# Altium project project_pankov_control_board.PrjPcb
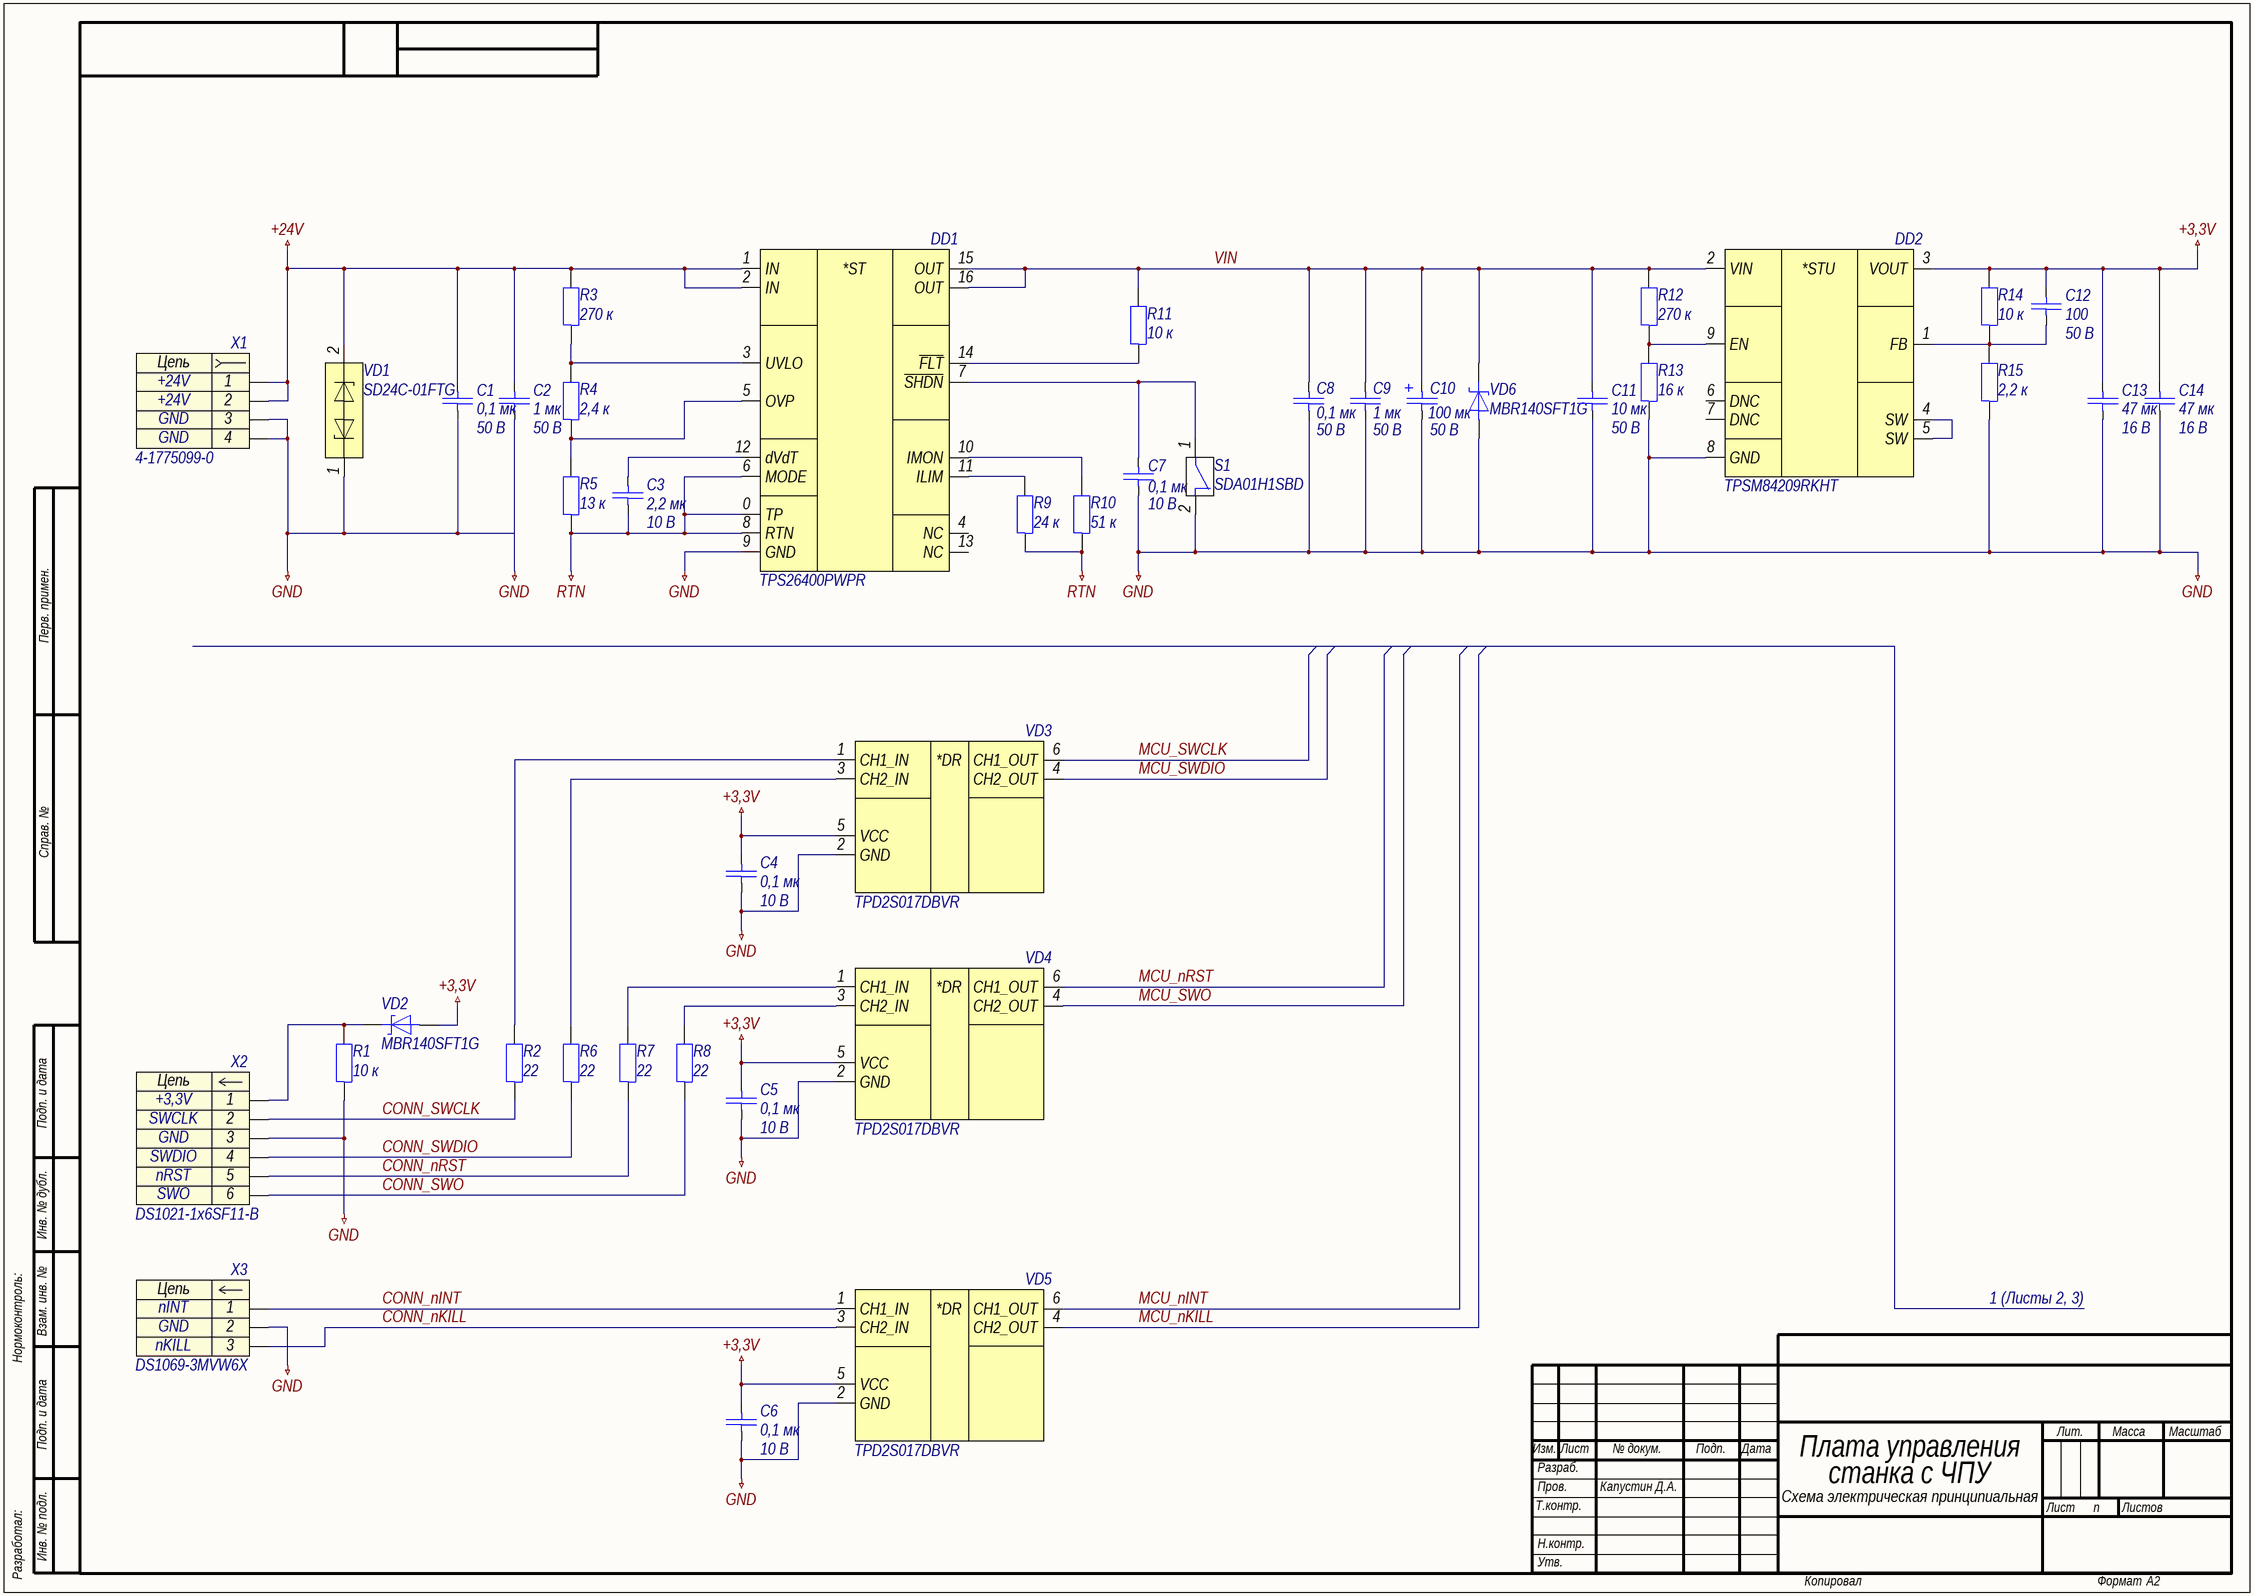
[diagram p0: project_pankov_1_power_supply.SchDoc]
approver: Капустин Д.А.; check: Капустин Д.А.; designation: СПБПУ.3331506.019; developer: Паньков И.С.; document_code: Ý3; document_type: Схема электрическая принципиальная; pcb_dec_number: СПБПУ.3331506.019; project: Плата управления станка с ЧПУ; sheets_total: 3; title: Плата управления станка с ЧПУ; title_line_1: Плата управления; title_line_2: станка с ЧПУ
3 sheets, 103 parts. Net scope: global (net labels, ports and power ports of the same name join across sheets).
Board file: project_pankov_control_board.PcbDoc
Sheets:
  project_pankov_1_power_supply.SchDoc
  project_pankov_2_mcu.SchDoc
  project_pankov_3_connectors.SchDoc

## Sheet project_pankov_1_power_supply.SchDoc: Плата управления станка с ЧПУ
size 594 x 420 mm; ApprovedBy: Капустин Д.А.; CheckedBy: Капустин Д.А.; DrawnBy: Паньков И.С.; DocumentNumber: СПБПУ.3331506.019Ý3; SheetNumber: n; SheetTotal: 3; DocumentCode: Ý3; ImagePath: СПБПУ.3331506.019

### Parts
C1  0,1 мк  Напряжение: 50 В  [C0603]
C2  1 мк  Напряжение: 50 В  [C0603]
C3  2,2 мк  Напряжение: 10 В  [C0603]
C4  0,1 мк  Напряжение: 10 В  [C0603]
C5  0,1 мк  Напряжение: 10 В  [C0603]
C6  0,1 мк  Напряжение: 10 В  [C0603]
C7  0,1 мк  Напряжение: 10 В  [C0603]
C8  0,1 мк  Напряжение: 50 В  [C0603]
C9  1 мк  Напряжение: 50 В  [C0603]
C10  100 мк  Напряжение: 50 В  [CAPAE-660X660X800]
C11  10 мк  Напряжение: 50 В  [C1206]
C12  100  Напряжение: 50 В  [C0603]
C13  47 мк  Напряжение: 16 В  [C1206]
C14  47 мк  Напряжение: 16 В  [C1206]
DD1  TPS26400PWPR  [HTSSOP-16-P65-500X440X120-L63X25-T246X266]
DD2  TPSM84209RKHT  [QFN-FCMOD-9-P65-450X400X210]
R1  10 к  [R0603]
R2  22  [R0603]
R3  270 к  [R0603]
R4  2,4 к  [R0603]
R5  13 к  [R0603]
R6  22  [R0603]
R7  22  [R0603]
R8  22  [R0603]
R9  24 к  [R0603]
R10  51 к  [R0603]
R11  10 к  [R0603]
R12  270 к  [R0603]
R13  16 к  [R0603]
R14  10 к  [R0603]
R15  2,2 к  [R0603]
S1  SDA01H1SBD  [SDA01H1SBD]
VD1  SD24C-01FTG  [SOD-323-257X130X114]
VD2  MBR140SFT1G  [SOD-123FL-370X165X98]
VD3  TPD2S017DBVR  [SOT-23-6-P95-290X280X145]
VD4  TPD2S017DBVR  [SOT-23-6-P95-290X280X145]
VD5  TPD2S017DBVR  [SOT-23-6-P95-290X280X145]
VD6  MBR140SFT1G  [SOD-123FL-370X165X98]
X1  4-1775099-0  [4-1775099-0]
X2  DS1021-1x6SF11-B  [DS1021-1X6SF11-B]
X3  DS1069-3MVW6X  [DS1069-3MVW6X]

### Nets
+3,3V: C4.1 C5.1 C6.1 C12.1 C13.1 C14.1 DD2.3(VOUT) R14.2 VD2.2 VD3.5(VCC) VD4.5(VCC) VD5.5(VCC)
+24V: C1.1 C2.1 DD1.1(IN) DD1.2(IN) R3.2 VD1.2 X1.1 X1.2
GND: C1.2 C2.2 C4.2 C5.2 C6.2 C7.2 C8.2 C9.2 C10.2 C11.2 C13.2 C14.2 DD1.9(GND) DD2.8(GND) R1.1 R13.1 R15.1 S1.2 VD1.1 VD3.2(GND) VD4.2(GND) VD5.2(GND) VD6.2 X1.3 X1.4 X2.3 X3.2
RTN: C3.2 DD1.0(TP) DD1.6(MODE) DD1.8(RTN) R5.1 R9.1 R10.1
CONN_nINT: VD5.1(CH1_IN) X3.1
CONN_nKILL: VD5.3(CH2_IN) X3.3
CONN_nRST: R7.1 X2.5
CONN_SWCLK: R2.1 X2.2
CONN_SWDIO: R6.1 X2.4
CONN_SWO: R8.1 X2.6
MCU_nINT: VD5.6(CH1_OUT)
MCU_nKILL: VD5.4(CH2_OUT)
MCU_nRST: VD4.6(CH1_OUT)
MCU_SWCLK: VD3.6(CH1_OUT)
MCU_SWDIO: VD3.4(CH2_OUT)
MCU_SWO: VD4.4(CH2_OUT)
VIN: C8.1 C9.1 C10.1 C11.1 DD1.15(OUT) DD1.16(OUT) DD2.2(VIN) R11.2 R12.2 VD6.1
NetC3_1: C3.1 DD1.12(dVdT)
NetC7_1: C7.1 DD1.7(~{SHDN}) S1.1
NetC12_2: C12.2 DD2.1(FB) R14.1 R15.2
NetDD1_3: DD1.3(UVLO) R3.1 R4.2
NetDD1_5: DD1.5(OVP) R4.1 R5.2
NetDD1_10: DD1.10(IMON) R10.2
NetDD1_11: DD1.11(ILIM) R9.2
NetDD1_14: DD1.14(~{FLT}) R11.1
NetDD2_4: DD2.4(SW) DD2.5(SW)
NetDD2_9: DD2.9(EN) R12.1 R13.2
NetR1_2: R1.2 VD2.1 X2.1
NetR2_2: R2.2 VD3.1(CH1_IN)
NetR6_2: R6.2 VD3.3(CH2_IN)
NetR7_2: R7.2 VD4.1(CH1_IN)
NetR8_2: R8.2 VD4.3(CH2_IN)

Not connected (* = marked no-connect by the designer): DD1 4(NC) 13(NC); DD2 6(DNC) 7(DNC)

### Notes on the sheet
- 1 (Листы 2, 3)
- Перв. примен.
- Справ. №
- Подп. и дата
- Инв. № дубл.
- Нормоконтроль:
- Взам. инв. №
- Изм.
- Лист
- № докум.
- Подп.
- Дата
- Лит.
- Масса
- Масштаб
- Т.контр.
- Пров.
- Разраб.
- Листов
- Разработал:
- Инв. № подл.
- Н.контр.
- Утв.
- Копировал
- Формат
- А2
- (in symbol dd0005) *ST
- (in symbol dd0020) *STU
- (in symbol vd0016) *DR
- (in symbol x0006) Цепь
- (in symbol x0028) Цепь
- (in symbol x0043) Цепь

### Library data of the parts
C1 C8 = c0065: =Описание; ID: c0065; Фамилия: Паньков; Описание: Конденсатор керамический чип 0603 100 нФ 50 В ±10 %; Наименование: CC0603KRX7R9BB104; Производитель: YAGEO Corp.; Отклонение: ±10 %; Рабочие температуры: от –55 °С до +125 °С; Температурный коэффициент емкости: X7R; Корпус: 0603; Номинал: 0,1 мк; Номинальное напряжение: 50 В; HelpURL: https://www.yageo.com/upload/media/product/productsearch/datasheet/mlcc/UPY-GPHC_X7R_6.3V-to-50V_20.pdf
C2 C9 = c0095: =Описание; ID: c0095; Фамилия: Паньков; Описание: Конденсатор керамический чип 0603 1 мкФ 50 В ±10 %; Наименование: CC0603KRX7R9BB105; Производитель: YAGEO Corp.; Отклонение: ±10 %; Рабочие температуры: от –55 °С до +125 °С; Температурный коэффициент емкости: X7R; Корпус: 0603; Номинал: 1 мк; Номинальное напряжение: 50 В; HelpURL: https://www.yageo.com/upload/media/product/productsearch/datasheet/mlcc/UPY-GPHC_X7R_6.3V-to-50V_20.pdf
C3 = c0100: =Описание; ID: c0100; Фамилия: Чернов; Описание: Конденсатор керамический чип 0603 2,2 мкФ 10 В ±10 %; Наименование: CC0603KRX7R6BB225; Производитель: YAGEO Corp.; Отклонение: ±10 %; Рабочие температуры: от –55 °С до +125 °С; Температурный коэффициент емкости: X7R; Корпус: 0603; Номинал: 2,2 мк; Номинальное напряжение: 10 В; HelpURL: https://www.yageo.com/upload/media/product/productsearch/datasheet/mlcc/UPY-GPHC_X7R_6.3V-to-50V_20.pdf
C4-C6 = c0077: =Описание; ID: c0077; Фамилия: Паньков; Описание: Конденсатор керамический чип 0603 100 нФ 10 В ±10 %; Наименование: CC0603KRX7R6BB104; Производитель: YAGEO Corp.; Отклонение: ±10 %; Рабочие температуры: от –55 °С до +125 °С; Температурный коэффициент емкости: X7R; Корпус: 0603; Номинал: 0,1 мк; Номинальное напряжение: 10 В; HelpURL: https://www.yageo.com/upload/media/product/productsearch/datasheet/mlcc/UPY-GPHC_X7R_6.3V-to-50V_20.pdf
C7 = c0057: =Описание; ID: c0057; Фамилия: Паньков; Описание: Конденсатор керамический чип 0603 100 нФ 10 В ±10 %; Наименование: CC0603KRX7R6BB104; Производитель: YAGEO Corp.; Отклонение: ±10 %; Рабочие температуры: от –55 °С до +125 °С; Температурный коэффициент емкости: X7R; Корпус: 0603; Номинал: 0,1 мк; Номинальное напряжение: 10 В; HelpURL: https://www.yageo.com/upload/media/product/productsearch/datasheet/mlcc/UPY-GPHC_X7R_6.3V-to-50V_20.pdf
C10 = c0168: =Описание; ID: c0168; Фамилия: Паньков; Описание: Конденсатор электролитический алюминиевый 100 мкФ 50 В ±20 %; Наименование: EEEFTH101XAP; Производитель: Panasonic Corporation; Отклонение: ±20 %; Эквивалентное последовательное сопротивление: 0,34 Ом; Среднеквадратичный размах пульсации тока: 0,35 А; Рабочие температуры: от –55 °С до +105 °С; Корпус: CAPAE (6,6 x 6,6 x 8,0); Номинал: 100 мк; Номинальное напряжение: 50 В; HelpURL: https://industrial.panasonic.com/ww/products/capacitors/aluminum-capacitors/aluminum-cap-smd/models/EEEFTH101XAP
C11 = c0148: =Описание; ID: c0148; Фамилия: Самарин; Описание: Конденсатор керамический чип 1206 10 мкФ 50 В ±10 %; Наименование: CC1206KKX5R9BB106; Производитель: YAGEO Corp.; Отклонение: ±10 %; Рабочие температуры: от –55 °С до +85 °С; Температурный коэффициент емкости: X5R; Корпус: 1206; Номинал: 10 мк; Номинальное напряжение: 50 В; HelpURL: https://www.yageo.com/upload/media/product/productsearch/datasheet/mlcc/UPY-GPHC_X5R_4V-to-50V_26.pdf
C12 = c0023: =Описание; ID: c0023; Фамилия: Паньков; Описание: Конденсатор керамический чип 0603 100 пФ 50 В ±1 %; Наименование: CC0603FRNPO9BN101; Производитель: YAGEO Corp.; Отклонение: ±1 %; Рабочие температуры: от –55 °С до +125 °С; Температурный коэффициент емкости: C0G; Корпус: 0603; Номинал: 100; Номинальное напряжение: 50 В; HelpURL: https://www.yageo.com/upload/media/product/productsearch/datasheet/mlcc/UPY-GP_NP0_16V-to-50V_18.pdf
C13 C14 = c0166: =Описание; ID: c0166; Фамилия: Паньков; Описание: Конденсатор керамический чип 1206 47 мкФ 16 В ±20 %; Наименование: CC1206MKX5R7BB476; Производитель: YAGEO Corp.; Отклонение: ±20 %; Рабочие температуры: от –55 °С до +85 °С; Температурный коэффициент емкости: X5R; Корпус: 1206; Номинал: 47 мк; Номинальное напряжение: 16 В; HelpURL: https://www.yageo.com/upload/media/product/productsearch/datasheet/mlcc/UPY-GPHC_X5R_4V-to-50V_26.pdf
DD1 = dd0005: =Описание; ID: dd0005; Фамилия: Паньков; Описание: Защитная микросхема eFuse 42 В и 2 А; Производитель: Texas Instruments Inc.; Напряжение: от 4,2 В до 42 В; Максимальное напряжение: 55 В; Ток: от 0,1 А до 2,23 А; Рабочие температуры: от –40 °С до +125 °С; Корпус: HTSSOP-16; Наименование: TPS26400PWPR; HelpURL: https://www.ti.com/product/TPS2640
DD2 = dd0020: =Описание; ID: dd0020; Фамилия: Паньков; Описание: Понижающий преобразователь напряжения 28 В и 2,5 А; Производитель: Texas Instruments Inc.; Входное напряжение: от 4,5 В до 28 В; Выходное напряжение: от 1,2 В до 6 В; Коммутируемый ток: до 2,5 А; Частота переключения: от 578 кГц до 923 кГц; Рабочие температуры: от –40 °С до +85 °С; Корпус: QFN-FCMOD-9; Наименование: TPSM84209RKHT; HelpURL: https://www.ti.com/product/TPSM84209
R1 R11 R14 = r0105: =Описание; ID: r0105; Фамилия: Самарин; Описание: Резистор чип 0603 10 кОм ±1 % 0,1 Вт; Наименование: RC0603FR-0710KL; Производитель: YAGEO Corp.; Отклонение: ±1 %; Номинальное напряжение: 75 В; Номинальный ток: 1 А; Рабочие температуры: от –55 °С до +155 °С; Корпус: 0603; Примечание: Ряд E24; Номинал: 10 к; HelpURL: https://www.yageo.com/upload/media/product/productsearch/datasheet/rchip/PYu-RC_Group_51_RoHS_L_11.pdf
R2 R6-R8 = r0034: =Описание; ID: r0034; Фамилия: Ларионов; Описание: Резистор чип 0603 22 Ом ±1 % 0,1 Вт; Наименование: RC0603FR-0722RL; Производитель: YAGEO Corp.; Отклонение: ±1 %; Номинальное напряжение: 75 В; Номинальный ток: 1 А; Рабочие температуры: от –55 °С до +155 °С; Корпус: 0603; Примечание: Ряд E24; Номинал: 22; HelpURL: https://www.yageo.com/upload/media/product/productsearch/datasheet/rchip/PYu-RC_Group_51_RoHS_L_11.pdf
R3 R12 = r0157: =Описание; ID: r0157; Фамилия: Паньков; Описание: Резистор чип 0603 270 кОм ±1 % 0,1 Вт; Наименование: RC0603FR-07270KL; Производитель: YAGEO Corp.; Отклонение: ±1 %; Номинальное напряжение: 75 В; Номинальный ток: 1 А; Рабочие температуры: от –55 °С до +155 °С; Корпус: 0603; Примечание: Ряд E24; Номинал: 270 к; HelpURL: https://www.yageo.com/upload/media/product/productsearch/datasheet/rchip/PYu-RC_Group_51_RoHS_L_11.pdf
R4 = r0086: =Описание; ID: r0086; Фамилия: Паньков; Описание: Резистор чип 0603 2,4 кОм ±1 % 0,1 Вт; Наименование: RC0603FR-072K4L; Производитель: YAGEO Corp.; Отклонение: ±1 %; Номинальное напряжение: 75 В; Номинальный ток: 1 А; Рабочие температуры: от –55 °С до +155 °С; Корпус: 0603; Примечание: Ряд E24; Номинал: 2,4 к; HelpURL: https://www.yageo.com/upload/media/product/productsearch/datasheet/rchip/PYu-RC_Group_51_RoHS_L_11.pdf
R5 = r0110: =Описание; ID: r0110; Фамилия: Жернаков; Описание: Резистор чип 0603 13 кОм ±1 % 0,1 Вт; Наименование: RC0603FR-0713KL; Производитель: YAGEO Corp.; Отклонение: ±1 %; Номинальное напряжение: 75 В; Номинальный ток: 1 А; Рабочие температуры: от –55 °С до +155 °С; Корпус: 0603; Примечание: Ряд E24; Номинал: 13 к; HelpURL: https://www.yageo.com/upload/media/product/productsearch/datasheet/rchip/PYu-RC_Group_51_RoHS_L_11.pdf
R9 = r0118: =Описание; ID: r0118; Фамилия: Паньков; Описание: Резистор чип 0603 24 кОм ±1 % 0,1 Вт; Наименование: RC0603FR-0724KL; Производитель: YAGEO Corp.; Отклонение: ±1 %; Номинальное напряжение: 75 В; Номинальный ток: 1 А; Рабочие температуры: от –55 °С до +155 °С; Корпус: 0603; Примечание: Ряд E24; Номинал: 24 к; HelpURL: https://www.yageo.com/upload/media/product/productsearch/datasheet/rchip/PYu-RC_Group_51_RoHS_L_11.pdf
R10 = r0131: =Описание; ID: r0131; Фамилия: Паньков; Описание: Резистор чип 0603 51 кОм ±1 % 0,1 Вт; Наименование: RC0603FR-0751KL; Производитель: YAGEO Corp.; Отклонение: ±1 %; Номинальное напряжение: 75 В; Номинальный ток: 1 А; Рабочие температуры: от –55 °С до +155 °С; Корпус: 0603; Примечание: Ряд E24; Номинал: 51 к; HelpURL: https://www.yageo.com/upload/media/product/productsearch/datasheet/rchip/PYu-RC_Group_51_RoHS_L_11.pdf
R13 = r0112: =Описание; ID: r0112; Фамилия: Паньков; Описание: Резистор чип 0603 16 кОм ±1 % 0,1 Вт; Наименование: RC0603FR-0716KL; Производитель: YAGEO Corp.; Отклонение: ±1 %; Номинальное напряжение: 75 В; Номинальный ток: 1 А; Рабочие температуры: от –55 °С до +155 °С; Корпус: 0603; Примечание: Ряд E24; Номинал: 16 к; HelpURL: https://www.yageo.com/upload/media/product/productsearch/datasheet/rchip/PYu-RC_Group_51_RoHS_L_11.pdf
R15 = r0085: =Описание; ID: r0085; Фамилия: Паньков; Описание: Резистор чип 0603 2,2 кОм ±1 % 0,1 Вт; Наименование: RC0603FR-072K2L; Производитель: YAGEO Corp.; Отклонение: ±1 %; Номинальное напряжение: 75 В; Номинальный ток: 1 А; Рабочие температуры: от –55 °С до +155 °С; Корпус: 0603; Примечание: Ряд E24; Номинал: 2,2 к; HelpURL: https://www.yageo.com/upload/media/product/productsearch/datasheet/rchip/PYu-RC_Group_51_RoHS_L_11.pdf
S1 = s0005: =Описание; ID: s0005; Фамилия: Паньков; Описание: 2-х позиционный движковый переключатель; Производитель: C&K; Ток нагрузки: 100 мА @ 5 В; Сопротивление контакта: 50 мОм; Количество контактов: 2; Рабочие температуры: от –40 °С до +85 °С; Промывка: Запрещена; Корпус: 4,52 х 9,30 х 5,45; Наименование: SDA01H1SBD; HelpURL: https://www.ckswitches.com/products/switches/product-details/DIP/SDA/SDA01H1SBD/
VD1 = vd0007: =Описание; ID: vd0007; Фамилия: Игнатова; Описание: Двунаправленная диодная сборка для подавления помех 24 В; Производитель: Littelfuse, Inc.; Корпус: SOD-323; Наименование: SD24C-01FTG; HelpURL: https://www.littelfuse.com/products/tvs-diode-arrays/general-purpose-esd-protection/sdc/sd24c_01ftg.aspx
VD2 VD6 = vd0002: =Описание; ID: vd0002; Фамилия: Паньков; Описание: Диод Шоттки 40 В 1 А; Производитель: ON Semiconductor; Максимальное прямое напряжение: 0,88 В; Максимальное обратное напряжение: 40 В; Максимальный прямой ток: 1 А; Рабочие температуры: от –55 °С до +125 °С; Корпус: SOD-123FL; Наименование: MBR140SFT1G; HelpURL: https://www.onsemi.com/products/discretes-drivers/diodes-rectifiers/schottky-diodes-schottky-rectifiers/mbr140sf
VD3-VD5 = vd0016: =Описание; ID: vd0016; Фамилия: Паньков; Описание: Диодная сборка для подавления помех 5 В; Производитель: Texas Instruments Inc.; Корпус: SOT-23-6; Наименование: TPD2S017DBVR; HelpURL: https://www.ti.com/product/TPD2S017
X1 = x0006: =Описание; Contact_1: +24V; Contact_3: GND; ID: x0006; Фамилия: Ларионов; Описание: ATX Power 4 pin гнездо прямой; Производитель: TE Connectivity; Contact_2: +24V; Contact_4: GND; Наименование: 4-1775099-0; HelpURL: https://www.te.com/usa-en/product-4-1775099-0.html
X2 = x0028: =Описание; Contact_1: +3,3V; Contact_2: SWCLK; Contact_3: GND; Contact_4: SWDIO; Contact_5: nRST; Contact_6: SWO; ID: x0028; Фамилия: Паньков; Описание: PLS 6 pin 2,54 мм вилка прямой; Производитель: Connfly Electronic Co., Ltd.; Наименование: DS1021-1x6SF11-B; HelpURL: http://en.connfly.group/product/xVkr=EusQssAN0gN=Aos=mU+UrVkR9kqEAN0gN9g+WqANB+A
X3 = x0043: =Описание; Contact_1: nINT; Contact_2: GND; Contact_3: nKILL; ID: x0043; Фамилия: Паньков; Описание: CWF 3 pin 2,5 мм вилка прямой; Производитель: Connfly Electronic Co., Ltd.; Наименование: DS1069-3MVW6X; HelpURL: http://en.connfly.group/product/xVkr=EusQssAN0gN=Aos=mU+UrVkR9kqEAN0gN0MUR+g+NB+A

## Sheet project_pankov_2_mcu.SchDoc: Плата управления станка с ЧПУ
size 891 x 420 mm; ApprovedBy: Капустин Д.А.; CheckedBy: Капустин Д.А.; DrawnBy: Паньков И.С.; DocumentNumber: СПБПУ.3331506.019Ý3; SheetNumber: 2; SheetTotal: 3; DocumentCode: Ý3; ImagePath: СПБПУ.3331506.019
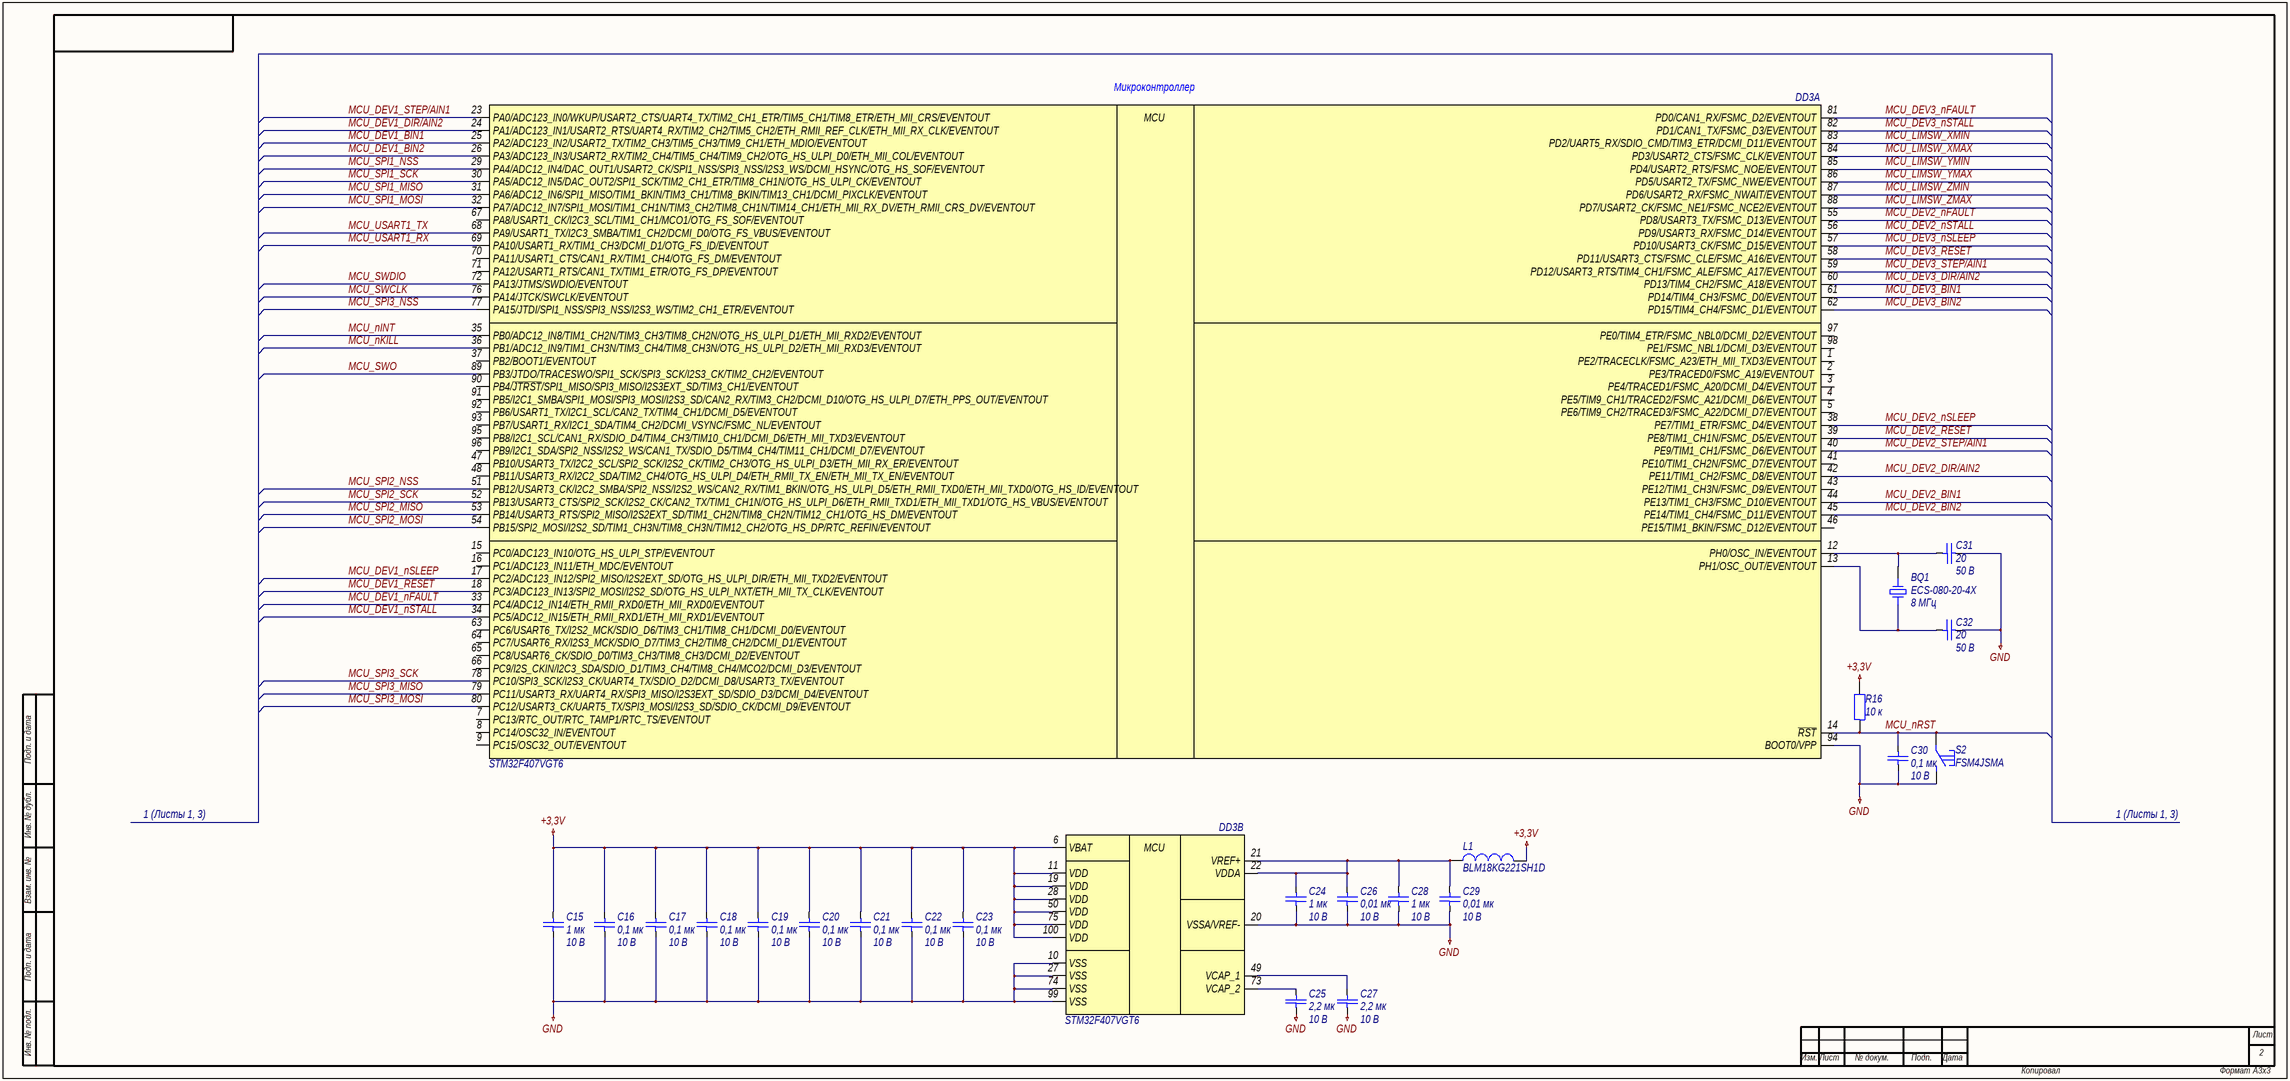
[diagram p1: project_pankov_2_mcu.SchDoc]

### Parts
BQ1  ECS-080-20-4X  Частотa: 8 МГц  [HC-49/US]
C15  1 мк  Напряжение: 10 В  [C0603]
C16  0,1 мк  Напряжение: 10 В  [C0603]
C17  0,1 мк  Напряжение: 10 В  [C0603]
C18  0,1 мк  Напряжение: 10 В  [C0603]
C19  0,1 мк  Напряжение: 10 В  [C0603]
C20  0,1 мк  Напряжение: 10 В  [C0603]
C21  0,1 мк  Напряжение: 10 В  [C0603]
C22  0,1 мк  Напряжение: 10 В  [C0603]
C23  0,1 мк  Напряжение: 10 В  [C0603]
C24  1 мк  Напряжение: 10 В  [C0603]
C25  2,2 мк  Напряжение: 10 В  [C0603]
C26  0,01 мк  Напряжение: 10 В  [C0603]
C27  2,2 мк  Напряжение: 10 В  [C0603]
C28  1 мк  Напряжение: 10 В  [C0603]
C29  0,01 мк  Напряжение: 10 В  [C0603]
C30  0,1 мк  Напряжение: 10 В  [C0603]
C31  20  Напряжение: 50 В  [C0603]
C32  20  Напряжение: 50 В  [C0603]
DD3  STM32F407VGT6  [LQFP-100-P50-1400X1400X160-L60X22]  (parts A,B of 2)
L1  BLM18KG221SH1D  [BLM-2-0603]
R16  10 к  [R0603]
S2  FSM4JSMA  [FSM4JSMA]

### Nets
+3,3V: C15.1 C16.1 C17.1 C18.1 C19.1 C20.1 C21.1 C22.1 C23.1 DD3.6(VBAT) DD3.11(VDD) DD3.19(VDD) DD3.28(VDD) DD3.50(VDD) DD3.75(VDD) DD3.100(VDD) L1.2 R16.2
GND: C15.2 C16.2 C17.2 C18.2 C19.2 C20.2 C21.2 C22.2 C23.2 C24.2 C25.2 C26.2 C27.2 C28.2 C29.2 C30.2 C31.1 C32.1 DD3.10(VSS) DD3.20(VSSA/VREF-) DD3.27(VSS) DD3.74(VSS) DD3.94(BOOT0/VPP) DD3.99(VSS) S2.2
MCU_DEV1_BIN1: DD3.25(PA2/ADC123_IN2/USART2_TX/TIM2_CH3/TIM5_CH3/TIM9_CH1/ETH_MDIO/EVENTOUT)
MCU_DEV1_BIN2: DD3.26(PA3/ADC123_IN3/USART2_RX/TIM2_CH4/TIM5_CH4/TIM9_CH2/OTG_HS_ULPI_D0/ETH_MII_COL/EVENTOUT)
MCU_DEV1_DIR/AIN2: DD3.24(PA1/ADC123_IN1/USART2_RTS/UART4_RX/TIM2_CH2/TIM5_CH2/ETH_RMII_REF_CLK/ETH_MII_RX_CLK/EVENTOUT)
MCU_DEV1_nFAULT: DD3.33(PC4/ADC12_IN14/ETH_RMII_RXD0/ETH_MII_RXD0/EVENTOUT)
MCU_DEV1_nSLEEP: DD3.17(PC2/ADC123_IN12/SPI2_MISO/I2S2EXT_SD/OTG_HS_ULPI_DIR/ETH_MII_TXD2/EVENTOUT)
MCU_DEV1_nSTALL: DD3.34(PC5/ADC12_IN15/ETH_RMII_RXD1/ETH_MII_RXD1/EVENTOUT)
MCU_DEV1_RESET: DD3.18(PC3/ADC123_IN13/SPI2_MOSI/I2S2_SD/OTG_HS_ULPI_NXT/ETH_MII_TX_CLK/EVENTOUT)
MCU_DEV1_STEP/AIN1: DD3.23(PA0/ADC123_IN0/WKUP/USART2_CTS/UART4_TX/TIM2_CH1_ETR/TIM5_CH1/TIM8_ETR/ETH_MII_CRS/EVENTOUT)
MCU_DEV2_BIN1: DD3.44(PE13/TIM1_CH3/FSMC_D10/EVENTOUT)
MCU_DEV2_BIN2: DD3.45(PE14/TIM1_CH4/FSMC_D11/EVENTOUT)
MCU_DEV2_DIR/AIN2: DD3.42(PE11/TIM1_CH2/FSMC_D8/EVENTOUT)
MCU_DEV2_nFAULT: DD3.55(PD8/USART3_TX/FSMC_D13/EVENTOUT)
MCU_DEV2_nSLEEP: DD3.38(PE7/TIM1_ETR/FSMC_D4/EVENTOUT)
MCU_DEV2_nSTALL: DD3.56(PD9/USART3_RX/FSMC_D14/EVENTOUT)
MCU_DEV2_RESET: DD3.39(PE8/TIM1_CH1N/FSMC_D5/EVENTOUT)
MCU_DEV2_STEP/AIN1: DD3.40(PE9/TIM1_CH1/FSMC_D6/EVENTOUT)
MCU_DEV3_BIN1: DD3.61(PD14/TIM4_CH3/FSMC_D0/EVENTOUT)
MCU_DEV3_BIN2: DD3.62(PD15/TIM4_CH4/FSMC_D1/EVENTOUT)
MCU_DEV3_DIR/AIN2: DD3.60(PD13/TIM4_CH2/FSMC_A18/EVENTOUT)
MCU_DEV3_nFAULT: DD3.81(PD0/CAN1_RX/FSMC_D2/EVENTOUT)
MCU_DEV3_nSLEEP: DD3.57(PD10/USART3_CK/FSMC_D15/EVENTOUT)
MCU_DEV3_nSTALL: DD3.82(PD1/CAN1_TX/FSMC_D3/EVENTOUT)
MCU_DEV3_RESET: DD3.58(PD11/USART3_CTS/FSMC_CLE/FSMC_A16/EVENTOUT)
MCU_DEV3_STEP/AIN1: DD3.59(PD12/USART3_RTS/TIM4_CH1/FSMC_ALE/FSMC_A17/EVENTOUT)
MCU_LIMSW_XMAX: DD3.84(PD3/USART2_CTS/FSMC_CLK/EVENTOUT)
MCU_LIMSW_XMIN: DD3.83(PD2/UART5_RX/SDIO_CMD/TIM3_ETR/DCMI_D11/EVENTOUT)
MCU_LIMSW_YMAX: DD3.86(PD5/USART2_TX/FSMC_NWE/EVENTOUT)
MCU_LIMSW_YMIN: DD3.85(PD4/USART2_RTS/FSMC_NOE/EVENTOUT)
MCU_LIMSW_ZMAX: DD3.88(PD7/USART2_CK/FSMC_NE1/FSMC_NCE2/EVENTOUT)
MCU_LIMSW_ZMIN: DD3.87(PD6/USART2_RX/FSMC_NWAIT/EVENTOUT)
MCU_nINT: DD3.35(PB0/ADC12_IN8/TIM1_CH2N/TIM3_CH3/TIM8_CH2N/OTG_HS_ULPI_D1/ETH_MII_RXD2/EVENTOUT)
MCU_nKILL: DD3.36(PB1/ADC12_IN9/TIM1_CH3N/TIM3_CH4/TIM8_CH3N/OTG_HS_ULPI_D2/ETH_MII_RXD3/EVENTOUT)
MCU_nRST: C30.1 DD3.14(~{RST}) R16.1 S2.1
MCU_SPI1_MISO: DD3.31(PA6/ADC12_IN6/SPI1_MISO/TIM1_BKIN/TIM3_CH1/TIM8_BKIN/TIM13_CH1/DCMI_PIXCLK/EVENTOUT)
MCU_SPI1_MOSI: DD3.32(PA7/ADC12_IN7/SPI1_MOSI/TIM1_CH1N/TIM3_CH2/TIM8_CH1N/TIM14_CH1/ETH_MII_RX_DV/ETH_RMII_CRS_DV/EVENTOUT)
MCU_SPI1_NSS: DD3.29(PA4/ADC12_IN4/DAC_OUT1/USART2_CK/SPI1_NSS/SPI3_NSS/I2S3_WS/DCMI_HSYNC/OTG_HS_SOF/EVENTOUT)
MCU_SPI1_SCK: DD3.30(PA5/ADC12_IN5/DAC_OUT2/SPI1_SCK/TIM2_CH1_ETR/TIM8_CH1N/OTG_HS_ULPI_CK/EVENTOUT)
MCU_SPI2_MISO: DD3.53(PB14/USART3_RTS/SPI2_MISO/I2S2EXT_SD/TIM1_CH2N/TIM8_CH2N/TIM12_CH1/OTG_HS_DM/EVENTOUT)
MCU_SPI2_MOSI: DD3.54(PB15/SPI2_MOSI/I2S2_SD/TIM1_CH3N/TIM8_CH3N/TIM12_CH2/OTG_HS_DP/RTC_REFIN/EVENTOUT)
MCU_SPI2_NSS: DD3.51(PB12/USART3_CK/I2C2_SMBA/SPI2_NSS/I2S2_WS/CAN2_RX/TIM1_BKIN/OTG_HS_ULPI_D5/ETH_RMII_TXD0/ETH_MII_TXD0/OTG_HS_ID/EVENTOUT)
MCU_SPI2_SCK: DD3.52(PB13/USART3_CTS/SPI2_SCK/I2S2_CK/CAN2_TX/TIM1_CH1N/OTG_HS_ULPI_D6/ETH_RMII_TXD1/ETH_MII_TXD1/OTG_HS_VBUS/EVENTOUT)
MCU_SPI3_MISO: DD3.79(PC11/USART3_RX/UART4_RX/SPI3_MISO/I2S3EXT_SD/SDIO_D3/DCMI_D4/EVENTOUT)
MCU_SPI3_MOSI: DD3.80(PC12/USART3_CK/UART5_TX/SPI3_MOSI/I2S3_SD/SDIO_CK/DCMI_D9/EVENTOUT)
MCU_SPI3_NSS: DD3.77(PA15/JTDI/SPI1_NSS/SPI3_NSS/I2S3_WS/TIM2_CH1_ETR/EVENTOUT)
MCU_SPI3_SCK: DD3.78(PC10/SPI3_SCK/I2S3_CK/UART4_TX/SDIO_D2/DCMI_D8/USART3_TX/EVENTOUT)
MCU_SWCLK: DD3.76(PA14/JTCK/SWCLK/EVENTOUT)
MCU_SWDIO: DD3.72(PA13/JTMS/SWDIO/EVENTOUT)
MCU_SWO: DD3.89(PB3/JTDO/TRACESWO/SPI1_SCK/SPI3_SCK/I2S3_CK/TIM2_CH2/EVENTOUT)
MCU_USART1_RX: DD3.69(PA10/USART1_RX/TIM1_CH3/DCMI_D1/OTG_FS_ID/EVENTOUT)
MCU_USART1_TX: DD3.68(PA9/USART1_TX/I2C3_SMBA/TIM1_CH2/DCMI_D0/OTG_FS_VBUS/EVENTOUT)
NetBQ1_1: BQ1.1 C32.2 DD3.13(PH1/OSC_OUT/EVENTOUT)
NetBQ1_2: BQ1.2 C31.2 DD3.12(PH0/OSC_IN/EVENTOUT)
NetC24_1: C24.1 C26.1 C28.1 C29.1 DD3.21(VREF+) DD3.22(VDDA) L1.1
NetC25_1: C25.1 DD3.73(VCAP_2)
NetC27_1: C27.1 DD3.49(VCAP_1)

Not connected (* = marked no-connect by the designer): DD3 1(PE2/TRACECLK/FSMC_A23/ETH_MII_TXD3/EVENTOUT) 2(PE3/TRACED0/FSMC_A19/EVENTOUT_) 3(PE4/TRACED1/FSMC_A20/DCMI_D4/EVENTOUT) 4(PE5/TIM9_CH1/TRACED2/FSMC_A21/DCMI_D6/EVENTOUT) 5(PE6/TIM9_CH2/TRACED3/FSMC_A22/DCMI_D7/EVENTOUT) 7(PC13/RTC_OUT/RTC_TAMP1/RTC_TS/EVENTOUT) 8(PC14/OSC32_IN/EVENTOUT) 9(PC15/OSC32_OUT/EVENTOUT) 15(PC0/ADC123_IN10/OTG_HS_ULPI_STP/EVENTOUT) 16(PC1/ADC123_IN11/ETH_MDC/EVENTOUT) 37(PB2/BOOT1/EVENTOUT) 41(PE10/TIM1_CH2N/FSMC_D7/EVENTOUT) 43(PE12/TIM1_CH3N/FSMC_D9/EVENTOUT) 46(PE15/TIM1_BKIN/FSMC_D12/EVENTOUT) 47(PB10/USART3_TX/I2C2_SCL/SPI2_SCK/I2S2_CK/TIM2_CH3/OTG_HS_ULPI_D3/ETH_MII_RX_ER/EVENTOUT) 48(PB11/USART3_RX/I2C2_SDA/TIM2_CH4/OTG_HS_ULPI_D4/ETH_RMII_TX_EN/ETH_MII_TX_EN/EVENTOUT) 63(PC6/USART6_TX/I2S2_MCK/SDIO_D6/TIM3_CH1/TIM8_CH1/DCMI_D0/EVENTOUT) 64(PC7/USART6_RX/I2S3_MCK/SDIO_D7/TIM3_CH2/TIM8_CH2/DCMI_D1/EVENTOUT) 65(PC8/USART6_CK/SDIO_D0/TIM3_CH3/TIM8_CH3/DCMI_D2/EVENTOUT) 66(PC9/I2S_CKIN/I2C3_SDA/SDIO_D1/TIM3_CH4/TIM8_CH4/MCO2/DCMI_D3/EVENTOUT) 67(PA8/USART1_CK/I2C3_SCL/TIM1_CH1/MCO1/OTG_FS_SOF/EVENTOUT) 70(PA11/USART1_CTS/CAN1_RX/TIM1_CH4/OTG_FS_DM/EVENTOUT) 71(PA12/USART1_RTS/CAN1_TX/TIM1_ETR/OTG_FS_DP/EVENTOUT) 90(PB4/~{JTRST}/SPI1_MISO/SPI3_MISO/I2S3EXT_SD/TIM3_CH1/EVENTOUT) 91(PB5/I2C1_SMBA/SPI1_MOSI/SPI3_MOSI/I2S3_SD/CAN2_RX/TIM3_CH2/DCMI_D10/OTG_HS_ULPI_D7/ETH_PPS_OUT/EVENTOUT) 92(PB6/USART1_TX/I2C1_SCL/CAN2_TX/TIM4_CH1/DCMI_D5/EVENTOUT) 93(PB7/USART1_RX/I2C1_SDA/TIM4_CH2/DCMI_VSYNC/FSMC_NL/EVENTOUT) 95(PB8/I2C1_SCL/CAN1_RX/SDIO_D4/TIM4_CH3/TIM10_CH1/DCMI_D6/ETH_MII_TXD3/EVENTOUT) 96(PB9/I2C1_SDA/SPI2_NSS/I2S2_WS/CAN1_TX/SDIO_D5/TIM4_CH4/TIM11_CH1/DCMI_D7/EVENTOUT) 97(PE0/TIM4_ETR/FSMC_NBL0/DCMI_D2/EVENTOUT) 98(PE1/FSMC_NBL1/DCMI_D3/EVENTOUT)

### Notes on the sheet
- (near DD3) Микроконтроллер
- 1 (Листы 1, 3)
- Подп. и дата
- Инв. № дубл.
- Взам. инв. №
- Инв. № подл.
- Лист
- Изм.
- № докум.
- Подп.
- Дата
- Копировал
- Формат
- А3х3
- (in symbol dd0002, part A) MCU
- (in symbol dd0002, part B) MCU

### Library data of the parts
BQ1 = bq0004: =Описание; ID: bq0004; Фамилия: Паньков; Описание: Кварцевый резонатор 8 МГц нагрузочные конденсаторы 20 пФ; Производитель: ECS, Inc. International; Наименование: ECS-080-20-4X; Частота: 8 МГц; Корпус: HC-49/US; HelpURL: https://ecsxtal.com/hc-49usx
C15 C24 C28 = c0086: =Описание; ID: c0086; Фамилия: Паньков; Описание: Конденсатор керамический чип 0603 1 мкФ 10 В ±10 %; Наименование: CC0603KRX7R6BB105; Производитель: YAGEO Corp.; Отклонение: ±10 %; Рабочие температуры: от –55 °С до +125 °С; Температурный коэффициент емкости: X7R; Корпус: 0603; Номинал: 1 мк; Номинальное напряжение: 10 В; HelpURL: https://www.yageo.com/upload/media/product/productsearch/datasheet/mlcc/UPY-GPHC_X7R_6.3V-to-50V_20.pdf
C16-C23 = c0054: =Описание; ID: c0054; Фамилия: Паньков; Описание: Конденсатор керамический чип 0603 100 нФ 10 В ±10 %; Наименование: CC0603KRX7R6BB104; Производитель: YAGEO Corp.; Отклонение: ±10 %; Рабочие температуры: от –55 °С до +125 °С; Температурный коэффициент емкости: X7R; Корпус: 0603; Номинал: 0,1 мк; Номинальное напряжение: 10 В; HelpURL: https://www.yageo.com/upload/media/product/productsearch/datasheet/mlcc/UPY-GPHC_X7R_6.3V-to-50V_20.pdf
C25 C27 = c0097: =Описание; ID: c0097; Фамилия: Чернов; Описание: Конденсатор керамический чип 0603 2,2 мкФ 10 В ±10 %; Наименование: CC0603KRX7R6BB225; Производитель: YAGEO Corp.; Отклонение: ±10 %; Рабочие температуры: от –55 °С до +125 °С; Температурный коэффициент емкости: X7R; Корпус: 0603; Номинал: 2,2 мк; Номинальное напряжение: 10 В; HelpURL: https://www.yageo.com/upload/media/product/productsearch/datasheet/mlcc/UPY-GPHC_X7R_6.3V-to-50V_20.pdf
C26 C29 = c0033: =Описание; ID: c0033; Фамилия: Паньков; Описание: Конденсатор керамический чип 0603 10 нФ 10 В ±10 %; Наименование: CC0603KRX7R6BB103; Производитель: YAGEO Corp.; Отклонение: ±10 %; Рабочие температуры: от –55 °С до +125 °С; Температурный коэффициент емкости: X7R; Корпус: 0603; Номинал: 0,01 мк; Номинальное напряжение: 10 В; HelpURL: https://www.yageo.com/upload/media/product/productsearch/datasheet/mlcc/UPY-GPHC_X7R_6.3V-to-50V_20.pdf
C30 = c0057: as C7 on sheet project_pankov_1_power_supply; Номинал: 0,1 мк; Номинальное напряжение: 10 В; HelpURL: https://www.yageo.com/upload/media/product/productsearch/datasheet/mlcc/UPY-GPHC_X7R_6.3V-to-50V_20.pdf
C31 C32 = c0019: =Описание; ID: c0019; Фамилия: Паньков; Описание: Конденсатор керамический чип 0603 20 пФ 50 В ±1 %; Наименование: CC0603FRNPO9BN200; Производитель: YAGEO Corp.; Отклонение: ±1 %; Рабочие температуры: от –55 °С до +125 °С; Температурный коэффициент емкости: C0G; Корпус: 0603; Номинал: 20; Номинальное напряжение: 50 В; HelpURL: https://www.yageo.com/upload/media/product/productsearch/datasheet/mlcc/UPY-GP_NP0_16V-to-50V_18.pdf
DD3 = dd0002: =Описание; ID: dd0002; Фамилия: Паньков; Описание: ARM Cortex-M4 32-разрядный микроконтроллер 168 МГц 1 Мбайт FLASH-памяти; Производитель: STMicroelectronics; Рабочее напряжение: от 1,8 В до 3,6 В; Максимальная тактовая частота: 168 МГц; Поддерживаемые интерфейсы: CAN, I2C, SDIO, I2S/SPI, UART/USART, USB; Рабочие температуры: от –40 °С до +85 °С; Корпус: LQFP-100; Наименование: STM32F407VGT6; HelpURL: https://www.st.com/en/microcontrollers-microprocessors/stm32f407vg.html
L1 = l0001: =Описание; ID: l0001; Фамилия: Ларионов; Описание: Ферритовая бусина 220 Ом ±25 %; Производитель: Murata Manufacturing Co., Ltd.; Сопротивление, 100 МГц: 220 Ом; Отклонение, 100 МГц: ±25 %; Сопротивление при постоянном токе: 0,05 Ом; Рабочие температуры: от –55 °С до +125 °С; Корпус: 0603; Наименование: BLM18KG221SH1D; HelpURL: https://www.murata.com/en-global/products/productdetail?partno=BLM18KG221SH1%23
R16 = r0105: as R1 on sheet project_pankov_1_power_supply; Номинал: 10 к; HelpURL: https://www.yageo.com/upload/media/product/productsearch/datasheet/rchip/PYu-RC_Group_51_RoHS_L_11.pdf
S2 = s0001: =Описание; ID: s0001; Фамилия: Паньков; Описание: Тактовая кнопка поверхностного монтажа; Производитель: TE Connectivity; Ток нагрузки: 50 мА @ 24 В; Сопротивление контакта: 100 мОм; Количество контактов: 4; Рабочие температуры: от –35 °С до +85 °С; Промывка: Запрещена; Корпус: 6,00 x 6,00 x 4,98; Наименование: FSM4JSMA; HelpURL: https://www.te.com/usa-en/product-4-1437565-1.html

## Sheet project_pankov_3_connectors.SchDoc: Плата управления станка с ЧПУ
size 594 x 420 mm; ApprovedBy: Капустин Д.А.; CheckedBy: Капустин Д.А.; DrawnBy: Паньков И.С.; DocumentNumber: СПБПУ.3331506.019Ý3; SheetNumber: 3; SheetTotal: 3; DocumentCode: Ý3; ImagePath: СПБПУ.3331506.019
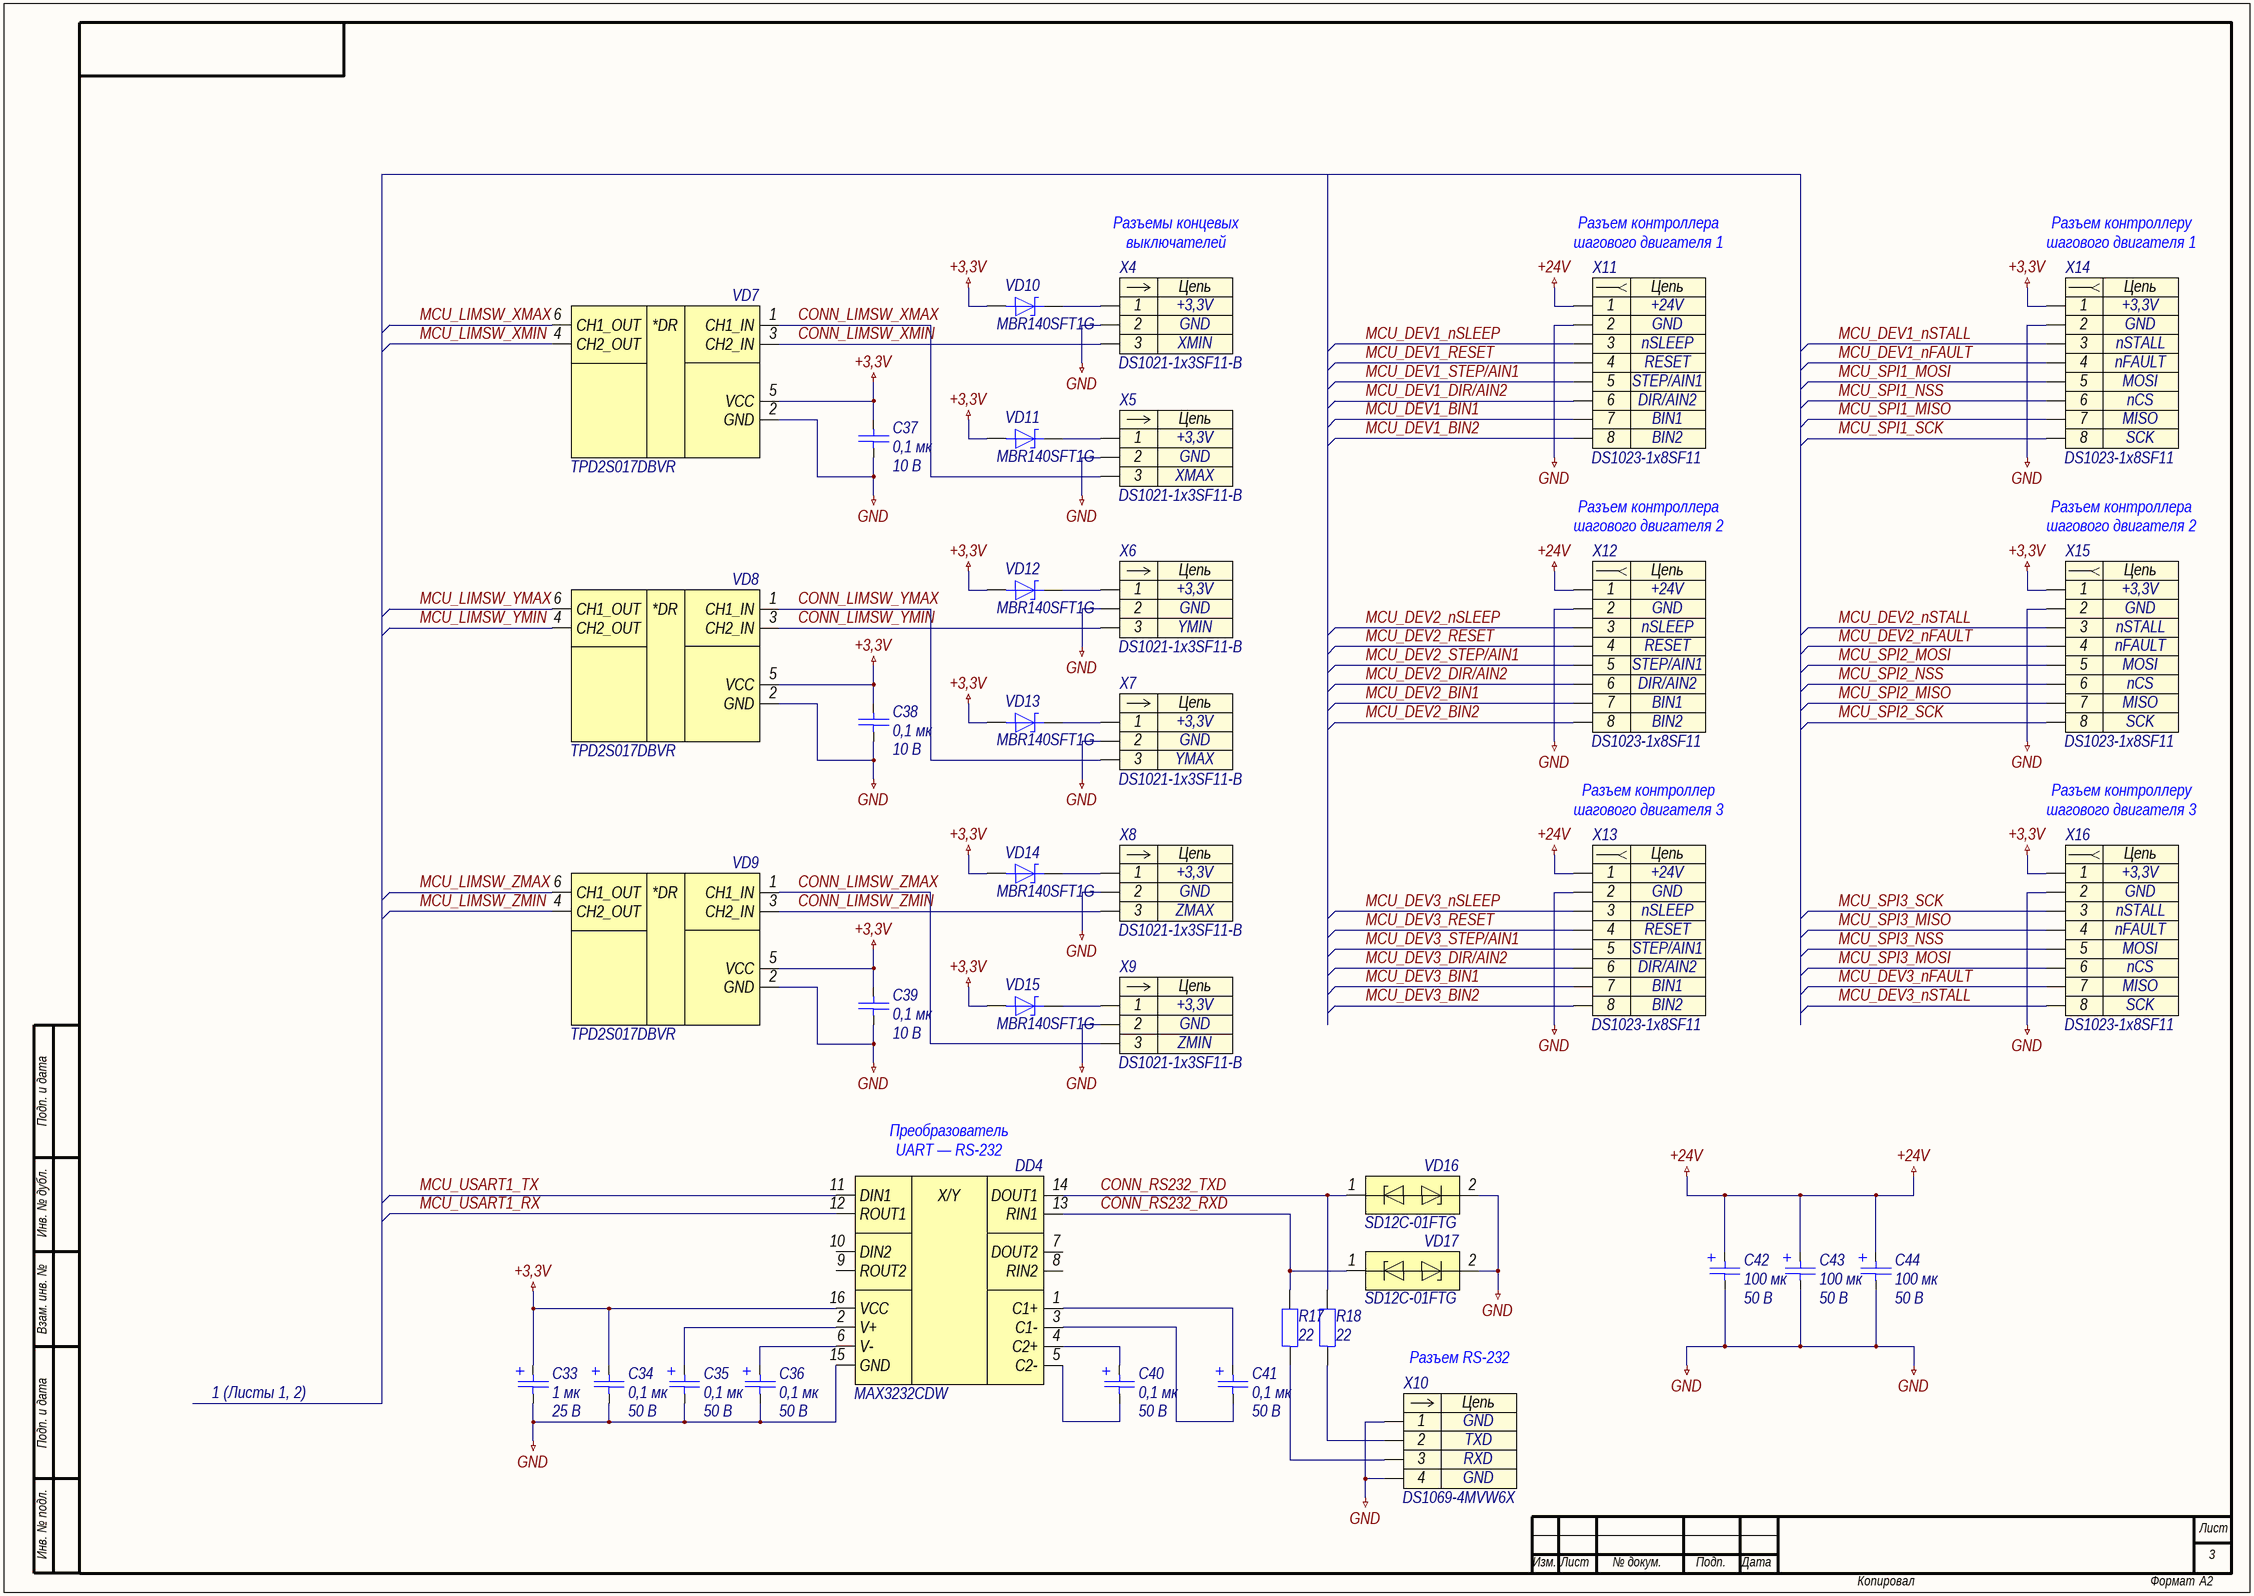
[diagram p2: project_pankov_3_connectors.SchDoc]

### Parts
C33  1 мк  Напряжение: 25 В  [C3216-18]
C34  0,1 мк  Напряжение: 50 В  [C3216-18]
C35  0,1 мк  Напряжение: 50 В  [C3216-18]
C36  0,1 мк  Напряжение: 50 В  [C3216-18]
C37  0,1 мк  Напряжение: 10 В  [C0603]
C38  0,1 мк  Напряжение: 10 В  [C0603]
C39  0,1 мк  Напряжение: 10 В  [C0603]
C40  0,1 мк  Напряжение: 50 В  [C3216-18]
C41  0,1 мк  Напряжение: 50 В  [C3216-18]
C42  100 мк  Напряжение: 50 В  [CAPAE-660X660X800]
C43  100 мк  Напряжение: 50 В  [CAPAE-660X660X800]
C44  100 мк  Напряжение: 50 В  [CAPAE-660X660X800]
DD4  MAX3232CDW  [SOIC-16-P127-1030X750X265-L84X41]
R17  22  [R0603]
R18  22  [R0603]
VD7  TPD2S017DBVR  [SOT-23-6-P95-290X280X145]
VD8  TPD2S017DBVR  [SOT-23-6-P95-290X280X145]
VD9  TPD2S017DBVR  [SOT-23-6-P95-290X280X145]
VD10  MBR140SFT1G  [SOD-123FL-370X165X98]
VD11  MBR140SFT1G  [SOD-123FL-370X165X98]
VD12  MBR140SFT1G  [SOD-123FL-370X165X98]
VD13  MBR140SFT1G  [SOD-123FL-370X165X98]
VD14  MBR140SFT1G  [SOD-123FL-370X165X98]
VD15  MBR140SFT1G  [SOD-123FL-370X165X98]
VD16  SD12C-01FTG  [SOD-323-257X130X114]
VD17  SD12C-01FTG  [SOD-323-257X130X114]
X4  DS1021-1x3SF11-B  [DS1021-1X3SF11-B]
X5  DS1021-1x3SF11-B  [DS1021-1X3SF11-B]
X6  DS1021-1x3SF11-B  [DS1021-1X3SF11-B]
X7  DS1021-1x3SF11-B  [DS1021-1X3SF11-B]
X8  DS1021-1x3SF11-B  [DS1021-1X3SF11-B]
X9  DS1021-1x3SF11-B  [DS1021-1X3SF11-B]
X10  DS1069-4MVW6X  [DS1069-4MVW6X]
X11  DS1023-1x8SF11  [DS1023-1X8SF11]
X12  DS1023-1x8SF11  [DS1023-1X8SF11]
X13  DS1023-1x8SF11  [DS1023-1X8SF11]
X14  DS1023-1x8SF11  [DS1023-1X8SF11]
X15  DS1023-1x8SF11  [DS1023-1X8SF11]
X16  DS1023-1x8SF11  [DS1023-1X8SF11]

### Nets
+3,3V: C33.1 C34.1 C37.1 C38.1 C39.1 DD4.16(VCC) VD7.5(VCC) VD8.5(VCC) VD9.5(VCC) VD10.2 VD11.2 VD12.2 VD13.2 VD14.2 VD15.2 X14.1 X15.1 X16.1
+24V: C42.1 C43.1 C44.1 X11.1 X12.1 X13.1
GND: C33.2 C34.2 C35.2 C36.2 C37.2 C38.2 C39.2 C42.2 C43.2 C44.2 DD4.15(GND) VD7.2(GND) VD8.2(GND) VD9.2(GND) VD16.2 VD17.2 X4.2 X5.2 X6.2 X7.2 X8.2 X9.2 X10.1 X10.4 X11.2 X12.2 X13.2 X14.2 X15.2 X16.2
CONN_LIMSW_XMAX: VD7.1(CH1_IN) X5.3
CONN_LIMSW_XMIN: VD7.3(CH2_IN) X4.3
CONN_LIMSW_YMAX: VD8.1(CH1_IN) X7.3
CONN_LIMSW_YMIN: VD8.3(CH2_IN) X6.3
CONN_LIMSW_ZMAX: VD9.1(CH1_IN) X9.3
CONN_LIMSW_ZMIN: VD9.3(CH2_IN) X8.3
CONN_RS232_RXD: DD4.13(RIN1) R17.2 VD17.1
CONN_RS232_TXD: DD4.14(DOUT1) R18.2 VD16.1
MCU_DEV1_BIN1: X11.7
MCU_DEV1_BIN2: X11.8
MCU_DEV1_DIR/AIN2: X11.6
MCU_DEV1_nFAULT: X14.4
MCU_DEV1_nSLEEP: X11.3
MCU_DEV1_nSTALL: X14.3
MCU_DEV1_RESET: X11.4
MCU_DEV1_STEP/AIN1: X11.5
MCU_DEV2_BIN1: X12.7
MCU_DEV2_BIN2: X12.8
MCU_DEV2_DIR/AIN2: X12.6
MCU_DEV2_nFAULT: X15.4
MCU_DEV2_nSLEEP: X12.3
MCU_DEV2_nSTALL: X15.3
MCU_DEV2_RESET: X12.4
MCU_DEV2_STEP/AIN1: X12.5
MCU_DEV3_BIN1: X13.7
MCU_DEV3_BIN2: X13.8
MCU_DEV3_DIR/AIN2: X13.6
MCU_DEV3_nFAULT: X16.7
MCU_DEV3_nSLEEP: X13.3
MCU_DEV3_nSTALL: X16.8
MCU_DEV3_RESET: X13.4
MCU_DEV3_STEP/AIN1: X13.5
MCU_LIMSW_XMAX: VD7.6(CH1_OUT)
MCU_LIMSW_XMIN: VD7.4(CH2_OUT)
MCU_LIMSW_YMAX: VD8.6(CH1_OUT)
MCU_LIMSW_YMIN: VD8.4(CH2_OUT)
MCU_LIMSW_ZMAX: VD9.6(CH1_OUT)
MCU_LIMSW_ZMIN: VD9.4(CH2_OUT)
MCU_SPI1_MISO: X14.7
MCU_SPI1_MOSI: X14.5
MCU_SPI1_NSS: X14.6
MCU_SPI1_SCK: X14.8
MCU_SPI2_MISO: X15.7
MCU_SPI2_MOSI: X15.5
MCU_SPI2_NSS: X15.6
MCU_SPI2_SCK: X15.8
MCU_SPI3_MISO: X16.4
MCU_SPI3_MOSI: X16.6
MCU_SPI3_NSS: X16.5
MCU_SPI3_SCK: X16.3
MCU_USART1_RX: DD4.12(ROUT1)
MCU_USART1_TX: DD4.11(DIN1)
NetC35_1: C35.1 DD4.2(V+)
NetC36_1: C36.1 DD4.6(V-)
NetC40_1: C40.1 DD4.4(C2+)
NetC40_2: C40.2 DD4.5(C2-)
NetC41_1: C41.1 DD4.1(C1+)
NetC41_2: C41.2 DD4.3(C1-)
NetR17_1: R17.1 X10.3
NetR18_1: R18.1 X10.2
NetVD10_1: VD10.1 X4.1
NetVD11_1: VD11.1 X5.1
NetVD12_1: VD12.1 X6.1
NetVD13_1: VD13.1 X7.1
NetVD14_1: VD14.1 X8.1
NetVD15_1: VD15.1 X9.1

Not connected (* = marked no-connect by the designer): DD4 7(DOUT2) 8(RIN2) 9(ROUT2) 10(DIN2)

### Notes on the sheet
- Разъемы концевых
  выключателей
- Разъем контроллера
  шагового двигателя 1
- Разъем контроллеру
  шагового двигателя 1
- Разъем контроллера
  шагового двигателя 2
- Разъем контроллер
  шагового двигателя 3
- Разъем контроллеру
  шагового двигателя 3
- (near DD4) Преобразователь
  UART — RS-232
- 1 (Листы 1, 2)
- Разъем RS-232
- Подп. и дата
- Инв. № дубл.
- Взам. инв. №
- Инв. № подл.
- Лист
- Изм.
- № докум.
- Подп.
- Дата
- Копировал
- Формат
- А2
- (in symbol dd0016) X/Y
- (in symbol vd0016) *DR
- (in symbol x0026) Цепь
- (in symbol x0036) Цепь
- (in symbol x0045) Цепь

### Library data of the parts
C33 = c0014: =Описание; ID: c0014; Фамилия: Ларионов; Описание: Конденсатор танталовый чип 3216-18 1 мкФ 25 В ±10 %; Наименование: 293D105X9025A2TE3; Производитель: Vishay Intertechnology, Inc.; Отклонение: ±10 %; Эквивалентное последовательное сопротивление: 7,6 Ом; Среднеквадратичный размах пульсации тока: 0,10 А; Рабочие температуры: от –55 °С до +125 °С; Корпус: 3216-18; Номинал: 1 мк; Номинальное напряжение: 25 В; HelpURL: https://www.vishay.com/capacitors/list/product-40002/
C34-C36 C40 C41 = c0001: =Описание; ID: c0001; Фамилия: Ларионов; Описание: Конденсатор танталовый чип 3216-18 100 нФ 50 В ±10 %; Наименование: 293D104X9050A2TE3; Производитель: Vishay Intertechnology, Inc.; Отклонение: ±10 %; Эквивалентное последовательное сопротивление: 19,0 Ом; Среднеквадратичный размах пульсации тока: 0,06 А; Рабочие температуры: от –55 °С до +125 °С; Корпус: 3216-18; Номинал: 0,1 мк; Номинальное напряжение: 50 В; HelpURL: https://www.vishay.com/capacitors/list/product-40002/
C37-C39 = c0077: as C4 on sheet project_pankov_1_power_supply; Номинал: 0,1 мк; Номинальное напряжение: 10 В; HelpURL: https://www.yageo.com/upload/media/product/productsearch/datasheet/mlcc/UPY-GPHC_X7R_6.3V-to-50V_20.pdf
C42-C44 = c0168: as C10 on sheet project_pankov_1_power_supply; Номинал: 100 мк; Номинальное напряжение: 50 В; HelpURL: https://industrial.panasonic.com/ww/products/capacitors/aluminum-capacitors/aluminum-cap-smd/models/EEEFTH101XAP
DD4 = dd0016: =Описание; ID: dd0016; Фамилия: Паньков; Описание: Приемопередатчик RS-232; Производитель: Texas Instruments Inc.; Рабочие температуры: от 0 до +70 °C; Корпус: SOIC-16; Наименование: MAX3232CDW; HelpURL: https://www.ti.com/product/MAX3232
R17 R18 = r0004: =Описание; ID: r0004; Фамилия: Ларионов; Описание: Резистор чип 0603 22 Ом ±1 % 0,1 Вт; Наименование: RC0603FR-0722RL; Производитель: YAGEO Corp.; Отклонение: ±1 %; Номинальное напряжение: 75 В; Номинальный ток: 1 А; Рабочие температуры: от –55 °С до +155 °С; Корпус: 0603; Примечание: Ряд E24; Номинал: 22; HelpURL: https://www.yageo.com/upload/media/product/productsearch/datasheet/rchip/PYu-RC_Group_51_RoHS_L_11.pdf
VD7-VD9 = vd0016: as VD3 on sheet project_pankov_1_power_supply; Наименование: TPD2S017DBVR; HelpURL: https://www.ti.com/product/TPD2S017
VD10-VD15 = vd0002: as VD2 on sheet project_pankov_1_power_supply; Наименование: MBR140SFT1G; HelpURL: https://www.onsemi.com/products/discretes-drivers/diodes-rectifiers/schottky-diodes-schottky-rectifiers/mbr140sf
VD16 VD17 = vd0004: =Описание; ID: vd0004; Фамилия: Ларионов; Описание: Двунаправленная диодная сборка для подавления помех 12 В; Производитель: Littelfuse, Inc.; Корпус: SOD-323; Наименование: SD12C-01FTG; HelpURL: https://www.littelfuse.com/products/tvs-diode-arrays/general-purpose-esd-protection/sdc/sd12c_01ftg.aspx
X4 = x0026: =Описание; Contact_1: +3,3V; Contact_2: GND; Contact_3: XMIN; ID: x0026; Фамилия: Паньков; Описание: PLS 3 pin 2,54 мм вилка прямой; Производитель: Connfly Electronic Co., Ltd.; Наименование: DS1021-1x3SF11-B; HelpURL: http://en.connfly.group/product/xVkr=EusQssAN0gN=Aos=mU+UrVkR9kqEAN0gN9g+WqANB+A
X5 = x0026: =Описание; Contact_1: +3,3V; Contact_2: GND; Contact_3: XMAX; ID: x0026; Фамилия: Паньков; Описание: PLS 3 pin 2,54 мм вилка прямой; Производитель: Connfly Electronic Co., Ltd.; Наименование: DS1021-1x3SF11-B; HelpURL: http://en.connfly.group/product/xVkr=EusQssAN0gN=Aos=mU+UrVkR9kqEAN0gN9g+WqANB+A
X6 = x0026: =Описание; Contact_1: +3,3V; Contact_2: GND; Contact_3: YMIN; ID: x0026; Фамилия: Паньков; Описание: PLS 3 pin 2,54 мм вилка прямой; Производитель: Connfly Electronic Co., Ltd.; Наименование: DS1021-1x3SF11-B; HelpURL: http://en.connfly.group/product/xVkr=EusQssAN0gN=Aos=mU+UrVkR9kqEAN0gN9g+WqANB+A
X7 = x0026: =Описание; Contact_1: +3,3V; Contact_2: GND; Contact_3: YMAX; ID: x0026; Фамилия: Паньков; Описание: PLS 3 pin 2,54 мм вилка прямой; Производитель: Connfly Electronic Co., Ltd.; Наименование: DS1021-1x3SF11-B; HelpURL: http://en.connfly.group/product/xVkr=EusQssAN0gN=Aos=mU+UrVkR9kqEAN0gN9g+WqANB+A
X8 = x0026: =Описание; Contact_1: +3,3V; Contact_2: GND; Contact_3: ZMAX; ID: x0026; Фамилия: Паньков; Описание: PLS 3 pin 2,54 мм вилка прямой; Производитель: Connfly Electronic Co., Ltd.; Наименование: DS1021-1x3SF11-B; HelpURL: http://en.connfly.group/product/xVkr=EusQssAN0gN=Aos=mU+UrVkR9kqEAN0gN9g+WqANB+A
X9 = x0026: =Описание; Contact_1: +3,3V; Contact_2: GND; Contact_3: ZMIN; ID: x0026; Фамилия: Паньков; Описание: PLS 3 pin 2,54 мм вилка прямой; Производитель: Connfly Electronic Co., Ltd.; Наименование: DS1021-1x3SF11-B; HelpURL: http://en.connfly.group/product/xVkr=EusQssAN0gN=Aos=mU+UrVkR9kqEAN0gN9g+WqANB+A
X10 = x0045: =Описание; Contact_1: GND; Contact_2: TXD; Contact_3: RXD; ID: x0045; Фамилия: Паньков; Описание: CWF 4 pin 2,5 мм вилка прямой; Производитель: Connfly Electronic Co., Ltd.; Contact_4: GND; Наименование: DS1069-4MVW6X; HelpURL: http://en.connfly.group/product/xVkr=EusQssAN0gN=Aos=mU+UrVkR9kqEAN0gN0MUR+g+NB+A
X11-X13 = x0036: =Описание; Contact_1: +24V; Contact_2: GND; Contact_3: nSLEEP; Contact_4: RESET; Contact_5: STEP/AIN1; Contact_6: DIR/AIN2; Contact_7: BIN1; Contact_8: BIN2; ID: x0036; Фамилия: Паньков; Описание: PBS 8 pin 2,54 мм гнездо прямой; Производитель: Connfly Electronic Co., Ltd.; Наименование: DS1023-1x8SF11; HelpURL: http://en.connfly.group/product/xVkr=EusQssAN0gN=Aos=mU+UrVkR9kqEAN0gN0AUCUNB+A
X14-X16 = x0036: =Описание; Contact_1: +3,3V; Contact_2: GND; Contact_3: nSTALL; Contact_4: nFAULT; Contact_5: MOSI; Contact_6: nCS; Contact_7: MISO; Contact_8: SCK; ID: x0036; Фамилия: Паньков; Описание: PBS 8 pin 2,54 мм гнездо прямой; Производитель: Connfly Electronic Co., Ltd.; Наименование: DS1023-1x8SF11; HelpURL: http://en.connfly.group/product/xVkr=EusQssAN0gN=Aos=mU+UrVkR9kqEAN0gN0AUCUNB+A

## Nets that join several sheets
+3,3V: project_pankov_1_power_supply (12 pins), project_pankov_2_mcu (18 pins), project_pankov_3_connectors (18 pins)
+24V: project_pankov_1_power_supply (8 pins), project_pankov_3_connectors (6 pins)
GND: project_pankov_1_power_supply (27 pins), project_pankov_2_mcu (25 pins), project_pankov_3_connectors (30 pins)
MCU_DEV1_BIN1: project_pankov_2_mcu (DD3.25), project_pankov_3_connectors (X11.7)
MCU_DEV1_BIN2: project_pankov_2_mcu (DD3.26), project_pankov_3_connectors (X11.8)
MCU_DEV1_DIR/AIN2: project_pankov_2_mcu (DD3.24), project_pankov_3_connectors (X11.6)
MCU_DEV1_nFAULT: project_pankov_2_mcu (DD3.33), project_pankov_3_connectors (X14.4)
MCU_DEV1_nSLEEP: project_pankov_2_mcu (DD3.17), project_pankov_3_connectors (X11.3)
MCU_DEV1_nSTALL: project_pankov_2_mcu (DD3.34), project_pankov_3_connectors (X14.3)
MCU_DEV1_RESET: project_pankov_2_mcu (DD3.18), project_pankov_3_connectors (X11.4)
MCU_DEV1_STEP/AIN1: project_pankov_2_mcu (DD3.23), project_pankov_3_connectors (X11.5)
MCU_DEV2_BIN1: project_pankov_2_mcu (DD3.44), project_pankov_3_connectors (X12.7)
MCU_DEV2_BIN2: project_pankov_2_mcu (DD3.45), project_pankov_3_connectors (X12.8)
MCU_DEV2_DIR/AIN2: project_pankov_2_mcu (DD3.42), project_pankov_3_connectors (X12.6)
MCU_DEV2_nFAULT: project_pankov_2_mcu (DD3.55), project_pankov_3_connectors (X15.4)
MCU_DEV2_nSLEEP: project_pankov_2_mcu (DD3.38), project_pankov_3_connectors (X12.3)
MCU_DEV2_nSTALL: project_pankov_2_mcu (DD3.56), project_pankov_3_connectors (X15.3)
MCU_DEV2_RESET: project_pankov_2_mcu (DD3.39), project_pankov_3_connectors (X12.4)
MCU_DEV2_STEP/AIN1: project_pankov_2_mcu (DD3.40), project_pankov_3_connectors (X12.5)
MCU_DEV3_BIN1: project_pankov_2_mcu (DD3.61), project_pankov_3_connectors (X13.7)
MCU_DEV3_BIN2: project_pankov_2_mcu (DD3.62), project_pankov_3_connectors (X13.8)
MCU_DEV3_DIR/AIN2: project_pankov_2_mcu (DD3.60), project_pankov_3_connectors (X13.6)
MCU_DEV3_nFAULT: project_pankov_2_mcu (DD3.81), project_pankov_3_connectors (X16.7)
MCU_DEV3_nSLEEP: project_pankov_2_mcu (DD3.57), project_pankov_3_connectors (X13.3)
MCU_DEV3_nSTALL: project_pankov_2_mcu (DD3.82), project_pankov_3_connectors (X16.8)
MCU_DEV3_RESET: project_pankov_2_mcu (DD3.58), project_pankov_3_connectors (X13.4)
MCU_DEV3_STEP/AIN1: project_pankov_2_mcu (DD3.59), project_pankov_3_connectors (X13.5)
MCU_LIMSW_XMAX: project_pankov_2_mcu (DD3.84), project_pankov_3_connectors (VD7.6)
MCU_LIMSW_XMIN: project_pankov_2_mcu (DD3.83), project_pankov_3_connectors (VD7.4)
MCU_LIMSW_YMAX: project_pankov_2_mcu (DD3.86), project_pankov_3_connectors (VD8.6)
MCU_LIMSW_YMIN: project_pankov_2_mcu (DD3.85), project_pankov_3_connectors (VD8.4)
MCU_LIMSW_ZMAX: project_pankov_2_mcu (DD3.88), project_pankov_3_connectors (VD9.6)
MCU_LIMSW_ZMIN: project_pankov_2_mcu (DD3.87), project_pankov_3_connectors (VD9.4)
MCU_nINT: project_pankov_1_power_supply (VD5.6), project_pankov_2_mcu (DD3.35)
MCU_nKILL: project_pankov_1_power_supply (VD5.4), project_pankov_2_mcu (DD3.36)
MCU_nRST: project_pankov_1_power_supply (VD4.6), project_pankov_2_mcu (C30.1 DD3.14 R16.1 S2.1)
MCU_SPI1_MISO: project_pankov_2_mcu (DD3.31), project_pankov_3_connectors (X14.7)
MCU_SPI1_MOSI: project_pankov_2_mcu (DD3.32), project_pankov_3_connectors (X14.5)
MCU_SPI1_NSS: project_pankov_2_mcu (DD3.29), project_pankov_3_connectors (X14.6)
MCU_SPI1_SCK: project_pankov_2_mcu (DD3.30), project_pankov_3_connectors (X14.8)
MCU_SPI2_MISO: project_pankov_2_mcu (DD3.53), project_pankov_3_connectors (X15.7)
MCU_SPI2_MOSI: project_pankov_2_mcu (DD3.54), project_pankov_3_connectors (X15.5)
MCU_SPI2_NSS: project_pankov_2_mcu (DD3.51), project_pankov_3_connectors (X15.6)
MCU_SPI2_SCK: project_pankov_2_mcu (DD3.52), project_pankov_3_connectors (X15.8)
MCU_SPI3_MISO: project_pankov_2_mcu (DD3.79), project_pankov_3_connectors (X16.4)
MCU_SPI3_MOSI: project_pankov_2_mcu (DD3.80), project_pankov_3_connectors (X16.6)
MCU_SPI3_NSS: project_pankov_2_mcu (DD3.77), project_pankov_3_connectors (X16.5)
MCU_SPI3_SCK: project_pankov_2_mcu (DD3.78), project_pankov_3_connectors (X16.3)
MCU_SWCLK: project_pankov_1_power_supply (VD3.6), project_pankov_2_mcu (DD3.76)
MCU_SWDIO: project_pankov_1_power_supply (VD3.4), project_pankov_2_mcu (DD3.72)
MCU_SWO: project_pankov_1_power_supply (VD4.4), project_pankov_2_mcu (DD3.89)
MCU_USART1_RX: project_pankov_2_mcu (DD3.69), project_pankov_3_connectors (DD4.12)
MCU_USART1_TX: project_pankov_2_mcu (DD3.68), project_pankov_3_connectors (DD4.11)